# Altium project AUSB.PrjPcb
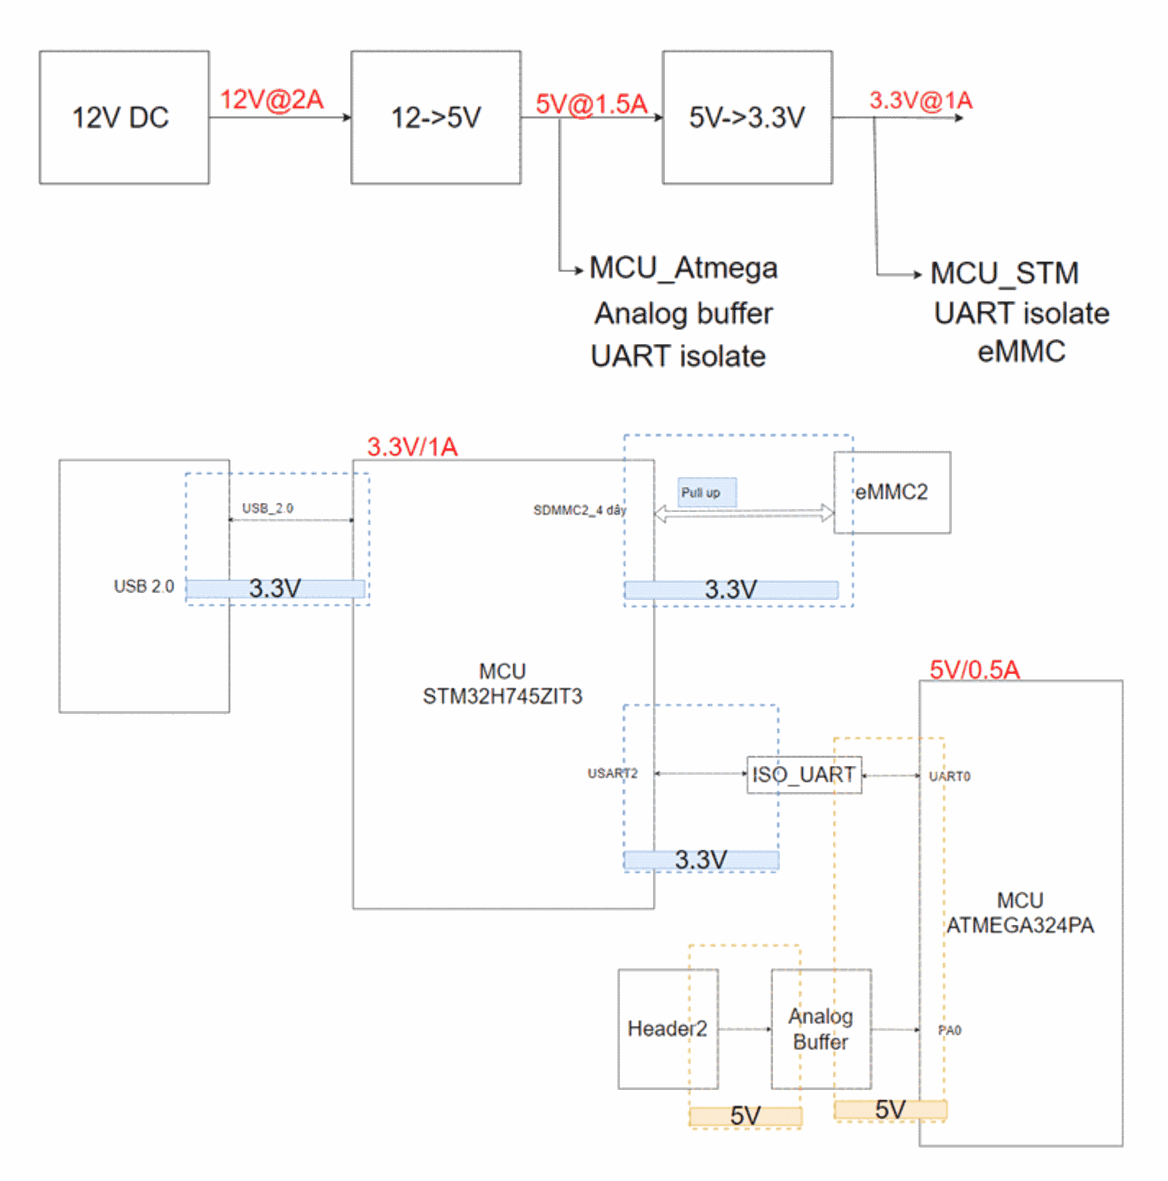
[diagram p0: 02_BLOCK DIAGRAM.SchDoc]
ApprovedBy: David; CheckedBy: David; Date: 02/26/2026; DrawnBy: cd; MasterProject: BEEE; Revision: 1.0.0; SubSystem: USB board
2 sheets, 20 parts. Net scope: global (net labels, ports and power ports of the same name join across sheets).
Board file: AUSB_PCB.PcbDoc
Sheets:
  02_BLOCK DIAGRAM.SchDoc
  eMMC.SchDoc

## Sheet 02_BLOCK DIAGRAM.SchDoc
size 420 x 297 mm; SheetNumber: 2; SheetTotal: 8

### Notes on the sheet
- Sub-system:
- Project:
- Design by:
- Sheet title:
- Sheet
- of
- Checked by:
- Approved by:
- Doc No:
- Revision:
- Size:
- Date:
- A3

## Sheet eMMC.SchDoc
size 420 x 297 mm; SheetNumber: 6; SheetTotal: 7
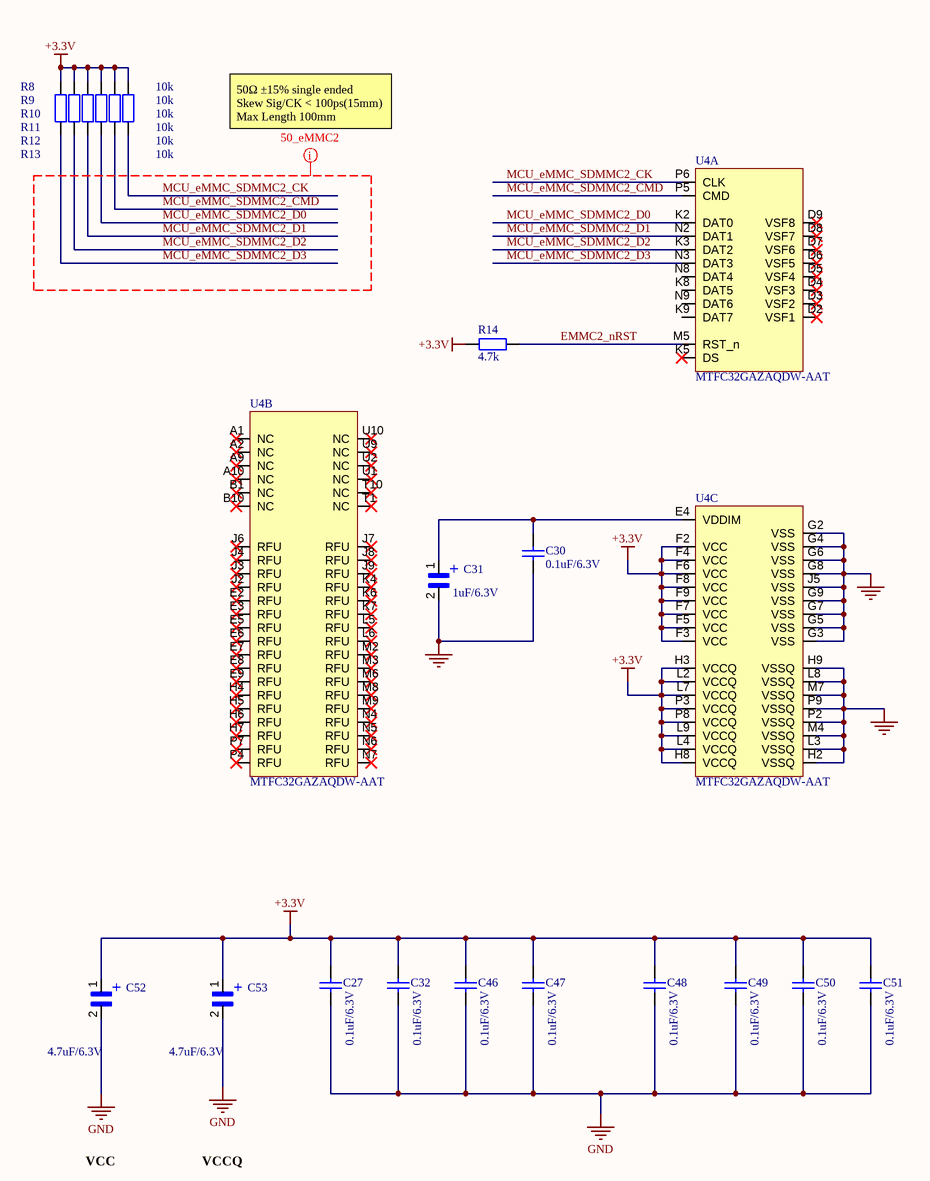
[diagram p1: eMMC.SchDoc]

### Parts
C27  0.1uF/6.3V  [CAP_C_1608X80]
C30  0.1uF/6.3V  [CAP_C_1608X80]
C31  1uF/6.3V  [CAP_MP_1608X90]
C32  0.1uF/6.3V  [CAP_C_1608X80]
C46  0.1uF/6.3V  [CAP_C_1608X80]
C47  0.1uF/6.3V  [CAP_C_1608X80]
C48  0.1uF/6.3V  [CAP_C_1608X80]
C49  0.1uF/6.3V  [CAP_C_1608X80]
C50  0.1uF/6.3V  [CAP_C_1608X80]
C51  0.1uF/6.3V  [CAP_C_1608X80]
C52  4.7uF/6.3V  [CAP_MP_1608X90]
C53  4.7uF/6.3V  [CAP_MP_1608X90]
R8  10k  [RES_C_1608X60]
R9  10k  [RES_C_1608X60]
R10  10k  [RES_C_1608X60]
R11  10k  [RES_C_1608X60]
R12  10k  [RES_C_1608X60]
R13  10k  [RES_C_1608X60]
R14  4.7k  [RES_C_1608X60]
U4  MTFC32GAZAQDW-AAT  [BGA_100_C_100P_10X17_1400X1800X150]  (parts A,B,C of 3)

### Nets
+3.3V: C27.1 C32.1 C46.1 C47.1 C48.1 C49.1 C50.1 C51.1 C52.1 C53.1 R8.2 R9.2 R10.2 R11.2 R12.2 R13.2 R14.1 U4.F2(VCC) U4.F3(VCC) U4.F4(VCC) U4.F5(VCC) U4.F6(VCC) U4.F7(VCC) U4.F8(VCC) U4.F9(VCC) U4.H3(VCCQ) U4.H8(VCCQ) U4.L2(VCCQ) U4.L4(VCCQ) U4.L7(VCCQ) U4.L9(VCCQ) U4.P3(VCCQ) U4.P8(VCCQ)
GND: C27.2 C30.2 C31.2 C32.2 C46.2 C47.2 C48.2 C49.2 C50.2 C51.2 C52.2 C53.2 U4.G2(VSS) U4.G3(VSS) U4.G4(VSS) U4.G5(VSS) U4.G6(VSS) U4.G7(VSS) U4.G8(VSS) U4.G9(VSS) U4.H2(VSSQ) U4.H9(VSSQ) U4.J5(VSS) U4.L3(VSSQ) U4.L8(VSSQ) U4.M4(VSSQ) U4.M7(VSSQ) U4.P2(VSSQ) U4.P9(VSSQ)
EMMC2_nRST: R14.2 U4.M5(RST_n)
MCU_eMMC_SDMMC2_CK: R13.1 U4.P6(CLK)
MCU_eMMC_SDMMC2_CMD: R12.1 U4.P5(CMD)
MCU_eMMC_SDMMC2_D0: R11.1 U4.K2(DAT0)
MCU_eMMC_SDMMC2_D1: R10.1 U4.N2(DAT1)
MCU_eMMC_SDMMC2_D2: R9.1 U4.K3(DAT2)
MCU_eMMC_SDMMC2_D3: R8.1 U4.N3(DAT3)
NetC30_1: C30.1 C31.1 U4.E4(VDDIM)

Not connected (* = marked no-connect by the designer): U4 A1(NC)* A2(NC)* A9(NC)* A10(NC)* B1(NC)* B10(NC)* D2(VSF1)* D3(VSF2)* D4(VSF3)* D5(VSF4)* D6(VSF5)* D7(VSF6)* D8(VSF7)* D9(VSF8)* E2(RFU)* E3(RFU)* E5(RFU)* E6(RFU)* E7(RFU)* E8(RFU)* E9(RFU)* H4(RFU)* H5(RFU)* H6(RFU)* H7(RFU)* J2(RFU)* J3(RFU)* J4(RFU)* J6(RFU)* J7(RFU)* J8(RFU)* J9(RFU)* K4(RFU)* K5(DS)* K6(RFU)* K7(RFU)* K8(DAT5) K9(DAT7) L5(RFU)* L6(RFU)* M2(RFU)* M3(RFU)* M6(RFU)* M8(RFU)* M9(RFU)* N4(RFU)* N5(RFU)* N6(RFU)* N7(RFU)* N8(DAT4) N9(DAT6) P4(RFU)* P7(RFU)* T1(NC)* T10(NC)* U1(NC)* U2(NC)* U9(NC)* U10(NC)*

### Layout directives
net class 50_eMMC2: MCU_eMMC_SDMMC2_CK, MCU_eMMC_SDMMC2_CMD, MCU_eMMC_SDMMC2_D0, MCU_eMMC_SDMMC2_D1, MCU_eMMC_SDMMC2_D2, MCU_eMMC_SDMMC2_D3

### Notes on the sheet
- 50Ω ±15% single ended
  Skew Sig/CK < 100ps(15mm)
  Max Length 100mm
- VCC
- VCCQ
- Sub-system:
- Project:
- Design by:
- Sheet title:
- Sheet
- of
- Checked by:
- Approved by:
- Doc No:
- Revision:
- Size:
- Date:
- A3
- (in symbol TACL335M003RTA) +

### Library data of the parts
C27 C30 C32 C46-C51 = Tu 0402 33nF 10V: CAPC; Chung_Loai: Dán; Don_Vi: Con; So_Chan: 2; Ten_Linh_Kien: Tụ 0402 33nF X7R 10V GRM155R71A333KA01D; Ma_Hang: MH007853; Kieu_Chan: *
C31 C52 C53 = TACL335M003RTA: CAPP; Package: None; Price: None; Value: *; MP: TACL335M003RTA; Availability: Unavailable
R8-R13 = Tro 0603 1% 10k: RES 4.7K OHM 1% 1/10W 0603, P/N: ERJ-U03F4701V; Chung_Loai: Dán; Don_Vi: Con; So_Chan: 2; Ten_Linh_Kien: Trở 0603 1% 10k; Ma_Hang: MH006333; Kieu_Chan: *
R14 = Tro 0603 1% 10k: RES; Chung_Loai: Dán; Don_Vi: Con; So_Chan: 2; Ten_Linh_Kien: Trở 0603 1% 10k; Ma_Hang: MH006333; Kieu_Chan: *